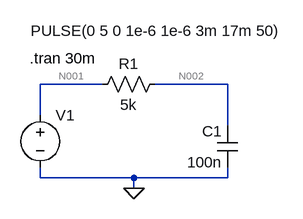
[diagram p0: schematic filter_design.asc]
filter_design.asc, the LTspice schematic file:
Version 4
SHEET 1 880 680
WIRE 208 80 112 80
WIRE 400 80 288 80
WIRE 112 128 112 80
WIRE 400 144 400 80
WIRE 112 224 112 208
WIRE 256 224 112 224
WIRE 400 224 400 208
WIRE 400 224 256 224
WIRE 256 240 256 224
FLAG 256 240 0
SYMBOL voltage 112 112 R0
WINDOW 3 -15 -114 Left 2
WINDOW 123 0 0 Left 0
WINDOW 39 0 0 Left 0
SYMATTR Value PULSE(0 5 0 1e-6 1e-6 3m 17m 50)
SYMATTR InstName V1
SYMBOL res 304 64 R90
WINDOW 0 0 56 VBottom 2
WINDOW 3 32 56 VTop 2
SYMATTR InstName R1
SYMATTR Value 5k
SYMBOL cap 416 208 R180
WINDOW 0 24 56 Left 2
WINDOW 3 24 8 Left 2
SYMATTR InstName C1
SYMATTR Value 100n
TEXT 96 40 Left 2 !.tran 30m

The netlist it stands for:
* filter_design.asc
V1 N001 0 PULSE(0 5 0 1e-6 1e-6 3m 17m 50)
R1 N002 N001 5k
C1 0 N002 100n
.tran 30m
.backanno
.end

* Results of the author's LTspice run, read from the files saved beside the schematic
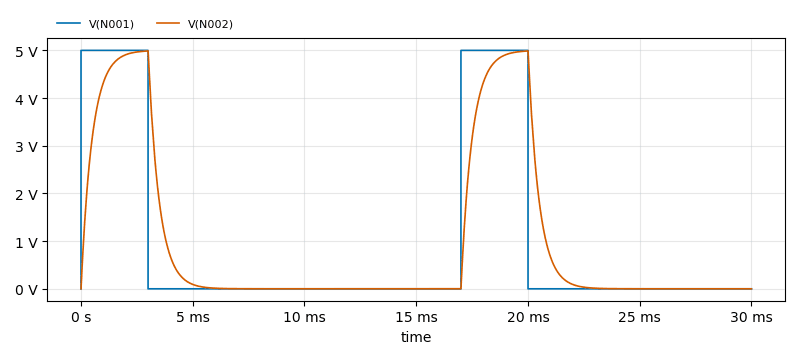
[diagram p1: Transient Analysis of filter_design.asc, plotted from the saved traces]
* Transient Analysis, 1 run:
*   V(N001): min 0 V, max 5 V, average 1 V, rms 2.236 V, last 0 V
*   V(N002): min 0 V, max 4.988 V, average 1.001 V, rms 2.044 V, last 0 V